# Altium project Dashboard.PrjPCB
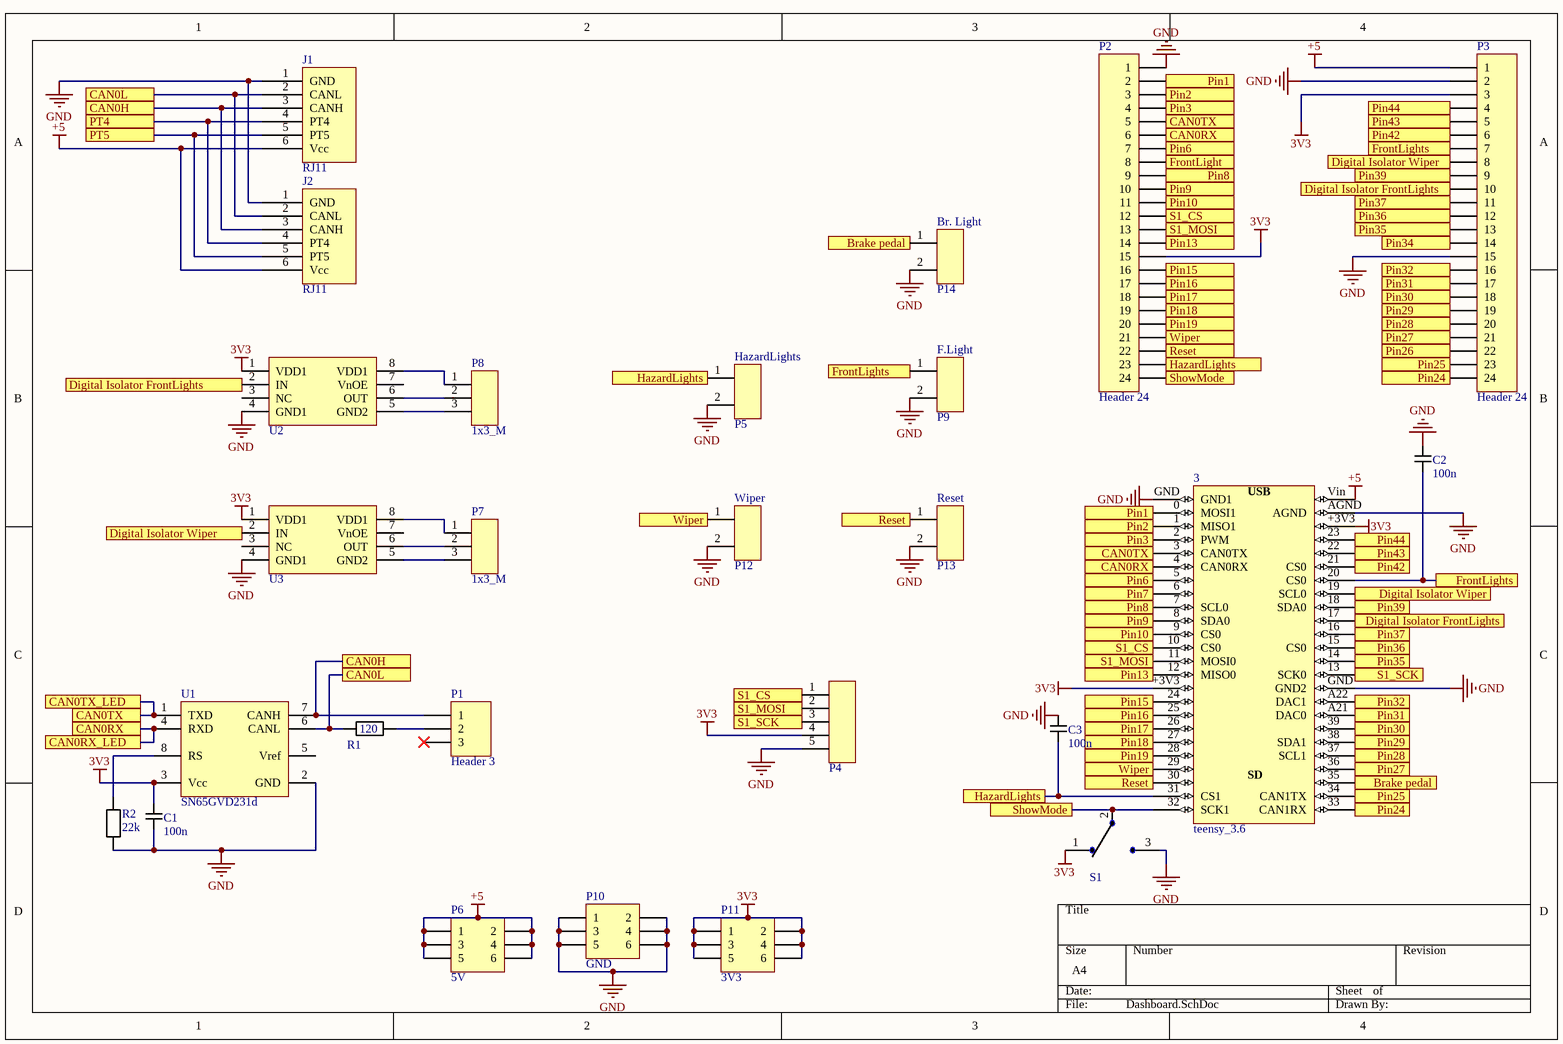
[diagram p0: Dashboard.SchDoc]
1 sheet, 26 parts. Net scope: flat (ports and power ports of the same name join across sheets).
Board file: Dashboard.PcbDoc

## Sheet Dashboard.SchDoc
size A4

### Parts
3  teensy_3.6  [teensy_3.6]
C1  value 100n  [C_SMD_0805_pcb]  (hidden comment: SMD)
C2  C2: 100n  [C_SMD_0805_pcb]  (hidden comment: SMD)
C3  C3: 100n  [C_SMD_0805_pcb]  (hidden comment: SMD)
J1  RJ11  [RJ11_Connector]
J2  RJ11  [RJ11_Connector]
P1  Header 3  [HDR1X3]
P2  Header 24  [HDR1X24]
P3  Header 24  [HDR1X24]
P4  JST_SE_5PIN  [JST_SE_5PIN]  (value not drawn)
P5  HazardLights  [JST_SE_2PIN]
P6  5V  [HDR2X3]
P7  1x3_M  [PIN_HEADER_M_1x3]
P8  1x3_M  [PIN_HEADER_M_1x3]
P9  F.Light  [JST_SE_2PIN]
P10  GND  [HDR2X3]
P11  3V3  [HDR2X3]
P12  Wiper  [JST_SE_2PIN]
P13  Reset  [JST_SE_2PIN]
P14  Br. Light  [JST_SE_2PIN]
R1  value 120  [R_SMD_0805_pcb]  (hidden comment: SMD)
R2  value 22k  [R_SMD_0805_pcb]  (hidden comment: SMD)
S1  SWITCH_3WAY_TOGGLE  [SWITCH_ATE]  (value not drawn)
U1  SN65GVD231d  [SN65HVD231D_SMD]
U2  IL_710-2E_DIGITAL_ISOLATOR  [IL_710-2E_DIP8]  (value not drawn)
U3  IL_710-2E_DIGITAL_ISOLATOR  [IL_710-2E_DIP8]  (value not drawn)

### Ports
Brake pedal, CAN0H, CAN0L, CAN0RX, CAN0RX_LED, CAN0TX, CAN0TX_LED, Digital Isolator FrontLights, Digital Isolator Wiper, FrontLight, FrontLights, HazardLights, Pin1, Pin2, Pin3, Pin6, Pin7, Pin8, Pin9, Pin10, Pin13, Pin15, Pin16, Pin17, Pin18, Pin19, Pin24, Pin25, Pin26, Pin27, Pin28, Pin29, Pin30, Pin31, Pin32, Pin34, Pin35, Pin36, Pin37, Pin39, Pin42, Pin43, Pin44, PT4, PT5, Reset, S1_CS, S1_MOSI, S1_SCK, ShowMode, Wiper

### Nets
3V3: 3.+3V3 C1.1 P2.15 P3.3 P4.4 P11.1 P11.2 P11.3 P11.4 P11.5 P11.6 S1.1 U1.3(Vcc) U2.1(VDD1) U3.1(VDD1)
+5: 3.Vin J1.6(Vcc) J2.6(Vcc) P3.1 P6.1 P6.2 P6.3 P6.4 P6.5 P6.6
GND: 3.AGND 3.GND(GND1) C1.2 C2.1 C3.1 J1.1(GND) J2.1(GND) P2.1 P3.2 P3.15 P4.5 P5.2 P9.2 P10.1 P10.2 P10.3 P10.4 P10.5 P10.6 P12.2 P13.2 P14.2 R2.1 S1.3 U1.2(GND) U2.4(GND1) U3.4(GND1)
Net3_0: 3.0(MOSI1) P2.2 ; port Pin1
Net3_1: 3.1(MISO1) P2.3 ; port Pin2
Net3_2: 3.2(PWM) P2.4 ; port Pin3
Net3_3: 3.3(CAN0TX) P2.5 U1.1(TXD) ; port CAN0TX, port CAN0TX_LED
Net3_4: 3.4(CAN0RX) P2.6 U1.4(RXD) ; port CAN0RX, port CAN0RX_LED
Net3_5: 3.5 P2.7 ; port Pin6
Net3_6: 3.6 ; port Pin7
Net3_7: 3.7(SCL0) P2.9 ; port Pin8
Net3_8: 3.8(SDA0) P2.10 ; port Pin9
Net3_9: 3.9(CS0) P2.11 ; port Pin10
Net3_10: 3.10(CS0) P2.12 P4.1 ; port S1_CS
Net3_11: 3.11(MOSI0) P2.13 P4.2 ; port S1_MOSI
Net3_12: 3.12(MISO0) P2.14 ; port Pin13
Net3_13: 3.13(SCK0) P4.3 ; port S1_SCK
Net3_14: 3.14 P3.13 ; port Pin35
Net3_15: 3.15(CS0) P3.12 ; port Pin36
Net3_16: 3.16 P3.11 ; port Pin37
Net3_17: 3.17 P3.10 U2.2(IN) ; port Digital Isolator FrontLights
Net3_18: 3.18(SDA0) P3.9 ; port Pin39
Net3_19: 3.19(SCL0) P3.8 U3.2(IN) ; port Digital Isolator Wiper
Net3_20: 3.20(CS0) C2.2 P3.7 P9.1 ; port FrontLights
Net3_21: 3.21(CS0) P3.6 ; port Pin42
Net3_22: 3.22 P3.5 ; port Pin43
Net3_23: 3.23 P3.4 ; port Pin44
Net3_24: 3.24 P2.16 ; port Pin15
Net3_25: 3.25 P2.17 ; port Pin16
Net3_26: 3.26 P2.18 ; port Pin17
Net3_27: 3.27 P2.19 ; port Pin18
Net3_28: 3.28 P2.20 ; port Pin19
Net3_29: 3.29 P2.21 P12.1 ; port Wiper
Net3_30: 3.30 P2.22 P13.1 ; port Reset
Net3_31: 3.31(CS1) C3.2 P2.23 P5.1 ; port HazardLights
Net3_32: 3.32(SCK1) P2.24 S1.2 ; port ShowMode
Net3_33: 3.33(CAN1RX) P3.24 ; port Pin24
Net3_34: 3.34(CAN1TX) P3.23 ; port Pin25
Net3_35: 3.35 P14.1 ; port Brake pedal
Net3_36: 3.36 P3.21 ; port Pin27
Net3_37: 3.37(SCL1) P3.20 ; port Pin28
Net3_38: 3.38(SDA1) P3.19 ; port Pin29
Net3_39: 3.39 P3.18 ; port Pin30
Net3_A21: 3.A21(DAC0) P3.17 ; port Pin31
Net3_A22: 3.A22(DAC1) P3.16 ; port Pin32
NetJ1_2: J1.2(CANL) J2.2(CANL) R1.1 U1.6(CANL) ; port CAN0L
NetJ1_3: J1.3(CANH) J2.3(CANH) P1.1 U1.7(CANH) ; port CAN0H
NetJ1_4: J1.4(PT4) J2.4(PT4) ; port PT4
NetJ1_5: J1.5(PT5) J2.5(PT5) ; port PT5
NetP1_2: P1.2 R1.2
NetP2_8: P2.8 ; port FrontLight
NetP3_14: P3.14 ; port Pin34
NetP3_22: P3.22 ; port Pin26
NetP7_1: P7.1 U3.8(VDD1)
NetP7_2: P7.2 U3.6(OUT)
NetP7_3: P7.3 U3.5(GND2)
NetP8_1: P8.1 U2.8(VDD1)
NetP8_2: P8.2 U2.6(OUT)
NetP8_3: P8.3 U2.5(GND2)
NetR2_2: R2.2 U1.8(RS)

Not connected (* = marked no-connect by the designer): P1 3*; U1 5(Vref); U2 3(NC) 7(VnOE); U3 3(NC) 7(VnOE)

### Notes on the sheet
- (in symbol teensy_3.6) USB; SD

### Library data of the parts
C1-C3 = C_SMD_0805: Supplier 1: *; Supplier Part Number 1: *
J1 J2 = RJ11_Connector: Supplier Part Number 1: *; Supplier 1: *
P1 = Header 3: Header, 3-Pin; LatestRevisionDate: 17-Jul-2002; LatestRevisionNote: Re-released for DXP Platform.; Publisher: Altium Limited
P2 P3 = Header 24: Header, 24-Pin; LatestRevisionDate: 17-Jul-2002; LatestRevisionNote: Re-released for DXP Platform.; Publisher: Altium Limited
P5 P9 P12-P14 = JST_SE_2PIN: Supplier 1: *; Supplier Part Number 1: *
P6 P10 P11 = Header 3X2: Header, 3-Pin, Dual row; LatestRevisionDate: 17-Jul-2002; LatestRevisionNote: Re-released for DXP Platform.; Publisher: Altium Limited
P7 P8 = PIN_HEADER_M_1x3: Supplier 1: *; Supplier Part Number 1: *
R1 R2 = R_SMD_0805: Supplier 1: *; Supplier Part Number 1: *
U1 = SN65HVD231D_SMD: Supplier 1: *; Supplier Part Number 1: *
U2 U3 = IL_710-2E_DIGITAL_ISOLATOR: Digital Isolator 3-5V input/output.; Supplier Part Number 1: *; Supplier 1: *
P4 = JST_SE_5PIN: Supplier 1: *; Supplier Part Number 1: *
S1 = SWITCH_3WAY_TOGGLE: Supplier 1: *; Supplier Part Number 1: *